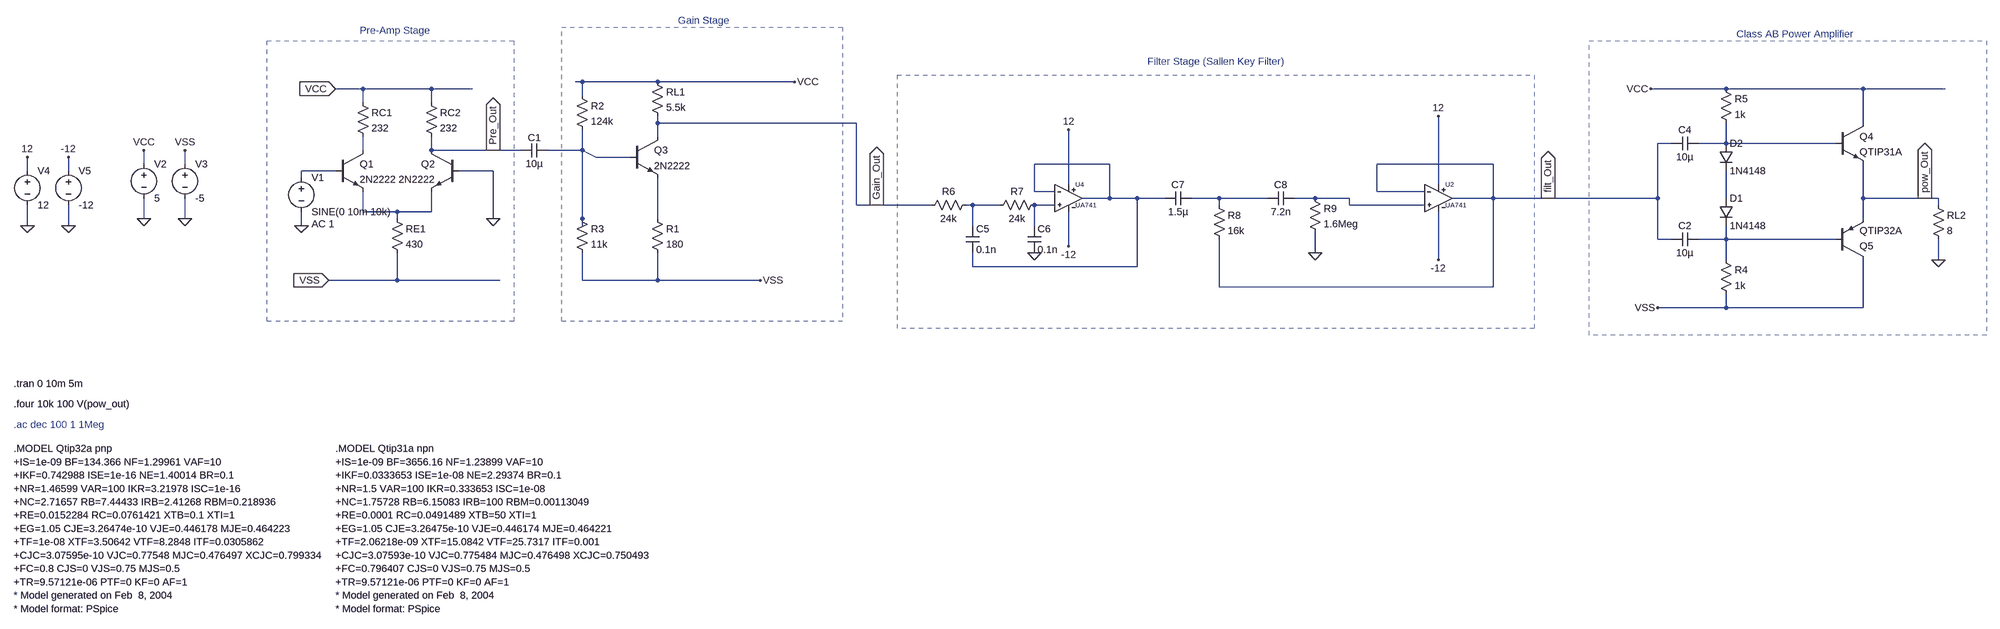
[diagram p0: schematic Final.asc]
Final.asc, the LTspice schematic file:
Version 4.1
SHEET 1 3748 1584
WIRE 160 0 144 0
WIRE 336 0 160 0
WIRE 656 0 336 0
WIRE -352 16 -416 16
WIRE -192 16 -352 16
WIRE -96 16 -192 16
WIRE 2832 16 2656 16
WIRE 3152 16 2832 16
WIRE 3344 16 3152 16
WIRE 160 32 160 0
WIRE -352 48 -352 16
WIRE -192 48 -192 16
WIRE 336 96 336 80
WIRE 800 96 336 96
WIRE 3152 96 3152 16
WIRE 336 128 336 96
WIRE 2704 144 2672 144
WIRE 2832 144 2832 96
WIRE 2832 144 2768 144
WIRE 3088 144 2832 144
WIRE -352 160 -352 128
WIRE -192 160 -192 128
WIRE -48 160 -192 160
WIRE 16 160 -48 160
WIRE 160 160 160 112
WIRE 160 160 80 160
WIRE 192 176 160 160
WIRE 272 176 192 176
WIRE -864 192 -864 160
WIRE -768 192 -768 160
WIRE 1392 192 1216 192
WIRE 2288 192 2016 192
WIRE -1136 208 -1136 176
WIRE -1040 208 -1040 176
WIRE -416 208 -496 208
WIRE -48 208 -128 208
WIRE -496 224 -496 208
WIRE 1296 240 1296 112
WIRE 2160 240 2160 80
WIRE 1216 256 1216 192
WIRE 1264 256 1216 256
WIRE 2016 256 2016 192
WIRE 2128 256 2016 256
WIRE 1392 272 1392 192
WIRE 1392 272 1328 272
WIRE 1456 272 1392 272
WIRE 1520 272 1456 272
WIRE 1648 272 1584 272
WIRE 1760 272 1648 272
WIRE 1872 272 1824 272
WIRE 1952 272 1872 272
WIRE 2288 272 2288 192
WIRE 2288 272 2192 272
WIRE 2416 272 2288 272
WIRE 2672 272 2672 144
WIRE 2672 272 2416 272
WIRE 2832 272 2832 208
WIRE 3152 272 3152 192
WIRE 3296 272 3152 272
WIRE 3328 272 3296 272
WIRE 800 288 800 96
WIRE 848 288 800 288
WIRE 976 288 848 288
WIRE 1072 288 1056 288
WIRE 1136 288 1072 288
WIRE 1264 288 1216 288
WIRE 1648 288 1648 272
WIRE 1952 288 1952 272
WIRE 2128 288 1952 288
WIRE 3328 288 3328 272
WIRE -352 304 -352 256
WIRE -272 304 -352 304
WIRE -192 304 -192 256
WIRE -192 304 -272 304
WIRE -864 320 -864 272
WIRE -768 320 -768 272
WIRE -272 320 -272 304
WIRE -48 320 -48 208
WIRE 160 320 160 160
WIRE 336 320 336 224
WIRE 3152 320 3152 272
WIRE -1136 336 -1136 288
WIRE -1040 336 -1040 288
WIRE -496 336 -496 304
WIRE 160 336 160 320
WIRE 1072 336 1072 288
WIRE 1216 336 1216 288
WIRE 2672 368 2672 272
WIRE 2704 368 2672 368
WIRE 2832 368 2832 336
WIRE 2832 368 2768 368
WIRE 3088 368 2832 368
WIRE 1296 384 1296 304
WIRE 1872 400 1872 352
WIRE 2160 416 2160 304
WIRE 2832 416 2832 368
WIRE 3328 416 3328 368
WIRE 1072 432 1072 400
WIRE 1456 432 1456 272
WIRE 1456 432 1072 432
WIRE -272 464 -272 400
WIRE -272 464 -432 464
WIRE -32 464 -272 464
WIRE 160 464 160 400
WIRE 336 464 336 400
WIRE 336 464 160 464
WIRE 576 464 336 464
WIRE 1648 480 1648 368
WIRE 2288 480 2288 272
WIRE 2288 480 1648 480
WIRE 2832 528 2832 496
WIRE 2832 528 2672 528
WIRE 3152 528 3152 416
WIRE 3152 528 2832 528
FLAG -48 320 0
FLAG -416 16 VCC
IOPIN -416 16 In
FLAG -432 464 VSS
IOPIN -432 464 In
FLAG -496 336 0
FLAG 656 0 VCC
FLAG 576 464 VSS
FLAG -864 320 0
FLAG -768 320 0
FLAG -864 160 VCC
FLAG -768 160 VSS
FLAG -1136 336 0
FLAG -1040 336 0
FLAG -1136 176 12
FLAG -1040 176 -12
FLAG 1296 112 12
FLAG 1296 384 -12
FLAG 1216 400 0
FLAG 1872 400 0
FLAG 2160 80 12
FLAG 2160 416 -12
FLAG 2656 16 VCC
FLAG 2672 528 VSS
FLAG 3328 416 0
FLAG 848 288 Gain_Out
IOPIN 848 288 Out
FLAG -48 160 Pre_Out
IOPIN -48 160 Out
FLAG 2416 272 filt_Out
IOPIN 2416 272 Out
FLAG 3296 272 pow_Out
IOPIN 3296 272 Out
SYMBOL npn -416 160 R0
SYMATTR InstName Q1
SYMATTR Value 2N2222
SYMBOL npn -128 160 M0
SYMATTR InstName Q2
SYMATTR Value 2N2222
SYMBOL res -288 304 R0
SYMATTR InstName RE1
SYMATTR Value 430
SYMBOL res -368 32 R0
SYMATTR InstName RC1
SYMATTR Value 232
SYMBOL res -208 32 R0
SYMATTR InstName RC2
SYMATTR Value 232
SYMBOL voltage -496 208 R0
WINDOW 123 24 124 Left 2
WINDOW 39 0 0 Left 0
SYMATTR Value2 AC 1
SYMATTR InstName V1
SYMATTR Value SINE(0 10m 10k)
SYMBOL npn 272 128 R0
SYMATTR InstName Q3
SYMATTR Value 2N2222
SYMBOL res 320 304 R0
SYMATTR InstName R1
SYMATTR Value 180
SYMBOL res 320 -16 R0
SYMATTR InstName RL1
SYMATTR Value 5.5k
SYMBOL res 144 16 R0
SYMATTR InstName R2
SYMATTR Value 124k
SYMBOL res 144 304 R0
SYMATTR InstName R3
SYMATTR Value 11k
SYMBOL cap 80 144 R90
WINDOW 0 2 32 VBottom 2
WINDOW 3 32 32 VTop 2
SYMATTR InstName C1
SYMATTR Value 10µ
SYMBOL voltage -864 176 R0
WINDOW 123 0 0 Left 0
WINDOW 39 0 0 Left 0
SYMATTR InstName V2
SYMATTR Value 5
SYMBOL voltage -768 176 R0
WINDOW 123 0 0 Left 0
WINDOW 39 0 0 Left 0
SYMATTR InstName V3
SYMATTR Value -5
SYMBOL voltage -1136 192 R0
WINDOW 123 0 0 Left 0
WINDOW 39 0 0 Left 0
SYMATTR InstName V4
SYMATTR Value 12
SYMBOL voltage -1040 192 R0
WINDOW 123 0 0 Left 0
WINDOW 39 0 0 Left 0
SYMATTR InstName V5
SYMATTR Value -12
SYMBOL res 1072 272 R90
WINDOW 0 0 56 VBottom 2
WINDOW 3 32 56 VTop 2
SYMATTR InstName R6
SYMATTR Value 24k
SYMBOL cap 1056 336 R0
SYMATTR InstName C5
SYMATTR Value 0.1n
SYMBOL res 1232 272 R90
WINDOW 0 0 56 VBottom 2
WINDOW 3 32 56 VTop 2
SYMATTR InstName R7
SYMATTR Value 24k
SYMBOL cap 1200 336 R0
SYMATTR InstName C6
SYMATTR Value 0.1n
SYMBOL cap 1584 256 R90
WINDOW 0 0 32 VBottom 2
WINDOW 3 32 32 VTop 2
SYMATTR InstName C7
SYMATTR Value 1.5µ
SYMBOL cap 1824 256 R90
WINDOW 0 0 32 VBottom 2
WINDOW 3 32 32 VTop 2
SYMATTR InstName C8
SYMATTR Value 7.2n
SYMBOL res 1632 272 R0
SYMATTR InstName R8
SYMATTR Value 16k
SYMBOL res 1856 256 R0
SYMATTR InstName R9
SYMATTR Value 1.6Meg
SYMBOL npn 3088 96 R0
SYMATTR InstName Q4
SYMATTR Value QTIP31A
SYMBOL diode 2816 272 R0
SYMATTR InstName D1
SYMATTR Value 1N4148
SYMBOL diode 2816 144 R0
SYMATTR InstName D2
SYMATTR Value 1N4148
SYMBOL pnp 3088 416 M180
SYMATTR InstName Q5
SYMATTR Value QTIP32A
SYMBOL cap 2768 352 R90
WINDOW 0 0 32 VBottom 2
WINDOW 3 32 32 VTop 2
SYMATTR InstName C2
SYMATTR Value 10µ
SYMBOL cap 2768 128 R90
WINDOW 0 0 32 VBottom 2
WINDOW 3 32 32 VTop 2
SYMATTR InstName C4
SYMATTR Value 10µ
SYMBOL res 2816 400 R0
SYMATTR InstName R4
SYMATTR Value 1k
SYMBOL res 2816 0 R0
SYMATTR InstName R5
SYMATTR Value 1k
SYMBOL res 3312 272 R0
SYMATTR InstName RL2
SYMATTR Value 8
SYMBOL UA741 1488 304 R0
SYMATTR InstName U4
SYMBOL UA741 2352 304 R0
SYMATTR InstName U2
TEXT -416 864 Left 2 !.MODEL Qtip31a npn\n+IS=1e-09 BF=3656.16 NF=1.23899 VAF=10\n+IKF=0.0333653 ISE=1e-08 NE=2.29374 BR=0.1\n+NR=1.5 VAR=100 IKR=0.333653 ISC=1e-08\n+NC=1.75728 RB=6.15083 IRB=100 RBM=0.00113049\n+RE=0.0001 RC=0.0491489 XTB=50 XTI=1\n+EG=1.05 CJE=3.26475e-10 VJE=0.446174 MJE=0.464221\n+TF=2.06218e-09 XTF=15.0842 VTF=25.7317 ITF=0.001\n+CJC=3.07593e-10 VJC=0.775484 MJC=0.476498 XCJC=0.750493\n+FC=0.796407 CJS=0 VJS=0.75 MJS=0.5\n+TR=9.57121e-06 PTF=0 KF=0 AF=1\n* Model generated on Feb  8, 2004\n* Model format: PSpice
TEXT -1168 712 Left 2 !.tran 0 10m 5m
TEXT -1168 760 Left 2 !.four 10k 100 V(pow_out)
TEXT -1168 808 Left 2 ;.ac dec 100 1 1Meg
TEXT -360 -120 Left 2 ;Pre-Amp Stage
TEXT 384 -144 Left 2 ;Gain Stage
TEXT 1480 -48 Left 2 ;Filter Stage (Sallen Key Filter)
TEXT 2856 -112 Left 2 ;Class AB Power Amplifier
TEXT -1168 864 Left 2 !.MODEL Qtip32a pnp\n+IS=1e-09 BF=134.366 NF=1.29961 VAF=10\n+IKF=0.742988 ISE=1e-16 NE=1.40014 BR=0.1\n+NR=1.46599 VAR=100 IKR=3.21978 ISC=1e-16\n+NC=2.71657 RB=7.44433 IRB=2.41268 RBM=0.218936\n+RE=0.0152284 RC=0.0761421 XTB=0.1 XTI=1\n+EG=1.05 CJE=3.26474e-10 VJE=0.446178 MJE=0.464223\n+TF=1e-08 XTF=3.50642 VTF=8.2848 ITF=0.0305862\n+CJC=3.07595e-10 VJC=0.77548 MJC=0.476497 XCJC=0.799334\n+FC=0.8 CJS=0 VJS=0.75 MJS=0.5\n+TR=9.57121e-06 PTF=0 KF=0 AF=1\n* Model generated on Feb  8, 2004\n* Model format: PSpice
RECTANGLE Normal 0 560 -576 -96 2
RECTANGLE Normal 768 560 112 -128 2
RECTANGLE Normal 2384 576 896 -16 2
RECTANGLE Normal 3440 592 2512 -96 2

The netlist it stands for:
* Final.asc
Q1 N002 N005 N011 0 2N2222
Q2 Pre_Out 0 N011 0 2N2222
RE1 N011 VSS 430
RC1 VCC N002 232
RC2 VCC Pre_Out 232
V1 N005 0 SINE(0 10m 10k) AC 1
Q3 Gain_Out N003 N012 0 2N2222
R1 N012 VSS 180
RL1 VCC Gain_Out 5.5k
R2 VCC N003 124k
R3 N003 VSS 11k
C1 N003 Pre_Out 10µ
V2 VCC 0 5
V3 VSS 0 -5
V4 12 0 12
V5 -12 0 -12
R6 N009 Gain_Out 24k
C5 N009 N004 0.1n
R7 N010 N009 24k
C6 N010 0 0.1n
C7 N006 N004 1.5µ
C8 N007 N006 7.2n
R8 N006 filt_Out 16k
R9 N007 0 1.6Meg
Q4 VCC N001 pow_Out 0 QTIP31A
D1 N008 N013 1N4148
D2 N001 N008 1N4148
Q5 VSS N013 pow_Out 0 QTIP32A
C2 N013 filt_Out 10µ
C4 N001 filt_Out 10µ
R4 N013 VSS 1k
R5 VCC N001 1k
RL2 pow_Out 0 8
X§U4 N010 N004 12 -12 N004 UA741  ; pins + 2 + ? 5
X§U2 N007 filt_Out 12 -12 filt_Out UA741  ; pins + 2 + ? 5
.model D D
.lib standard.dio
.model NPN NPN
.model PNP PNP
.lib standard.bjt
.MODEL Qtip31a npn
+IS=1e-09 BF=3656.16 NF=1.23899 VAF=10
+IKF=0.0333653 ISE=1e-08 NE=2.29374 BR=0.1
+NR=1.5 VAR=100 IKR=0.333653 ISC=1e-08
+NC=1.75728 RB=6.15083 IRB=100 RBM=0.00113049
+RE=0.0001 RC=0.0491489 XTB=50 XTI=1
+EG=1.05 CJE=3.26475e-10 VJE=0.446174 MJE=0.464221
+TF=2.06218e-09 XTF=15.0842 VTF=25.7317 ITF=0.001
+CJC=3.07593e-10 VJC=0.775484 MJC=0.476498 XCJC=0.750493
+FC=0.796407 CJS=0 VJS=0.75 MJS=0.5
+TR=9.57121e-06 PTF=0 KF=0 AF=1
* Model generated on Feb  8, 2004
* Model format: PSpice
.tran 0 10m 5m
.four 10k 100 V(pow_out)
* .ac dec 100 1 1Meg
* Pre-Amp Stage
* Gain Stage
* Filter Stage (Sallen Key Filter)
* Class AB Power Amplifier
.MODEL Qtip32a pnp
+IS=1e-09 BF=134.366 NF=1.29961 VAF=10
+IKF=0.742988 ISE=1e-16 NE=1.40014 BR=0.1
+NR=1.46599 VAR=100 IKR=3.21978 ISC=1e-16
+NC=2.71657 RB=7.44433 IRB=2.41268 RBM=0.218936
+RE=0.0152284 RC=0.0761421 XTB=0.1 XTI=1
+EG=1.05 CJE=3.26474e-10 VJE=0.446178 MJE=0.464223
+TF=1e-08 XTF=3.50642 VTF=8.2848 ITF=0.0305862
+CJC=3.07595e-10 VJC=0.77548 MJC=0.476497 XCJC=0.799334
+FC=0.8 CJS=0 VJS=0.75 MJS=0.5
+TR=9.57121e-06 PTF=0 KF=0 AF=1
* Model generated on Feb  8, 2004
* Model format: PSpice
.lib LTSPICE_model_files\UA741.301
.backanno
.end